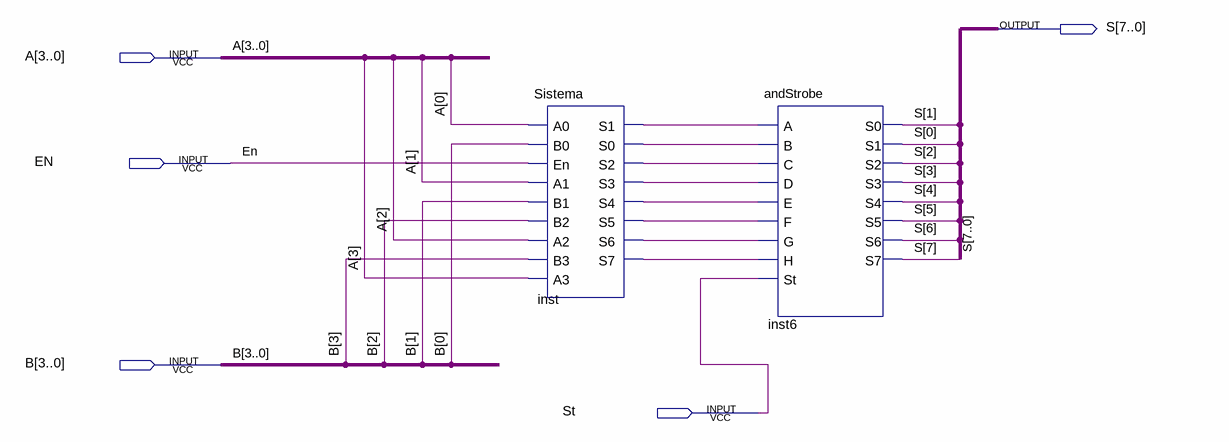
[diagram p0: schematic sheet]
// Quartus schematic Multiplier.bdf as structural Verilog: 2 symbols, 5 pins
module Multiplier (
  input  [3:0] A,
  input  EN,
  input  [3:0] B,
  input  St,
  output [7:0] S
);

  wire inst_s0, inst_s1, inst_s2, inst_s3, inst_s4, inst_s5, inst_s6, inst_s7;

  Sistema inst (
    .A0(A[0]), .B0(B[0]), .En(EN), .A1(A[1]), .B1(B[1]), .B2(B[2]), .A2(A[2]), .B3(B[3]), .A3(A[3]),
    .S1(inst_s1), .S0(inst_s0), .S2(inst_s2), .S3(inst_s3), .S4(inst_s4), .S5(inst_s5), .S6(inst_s6),
    .S7(inst_s7));
  andStrobe inst6 (
    .A(inst_s1), .B(inst_s0), .C(inst_s2), .D(inst_s3), .E(inst_s4), .F(inst_s5), .G(inst_s6), .H(inst_s7),
    .St(St), .S0(S[1]), .S1(S[0]), .S2(S[2]), .S3(S[3]), .S4(S[4]), .S5(S[5]), .S6(S[6]), .S7(S[7]));
endmodule
